# EAGLE board Speccy2007_128KY (EAGLE 6.4), part 1 of 2
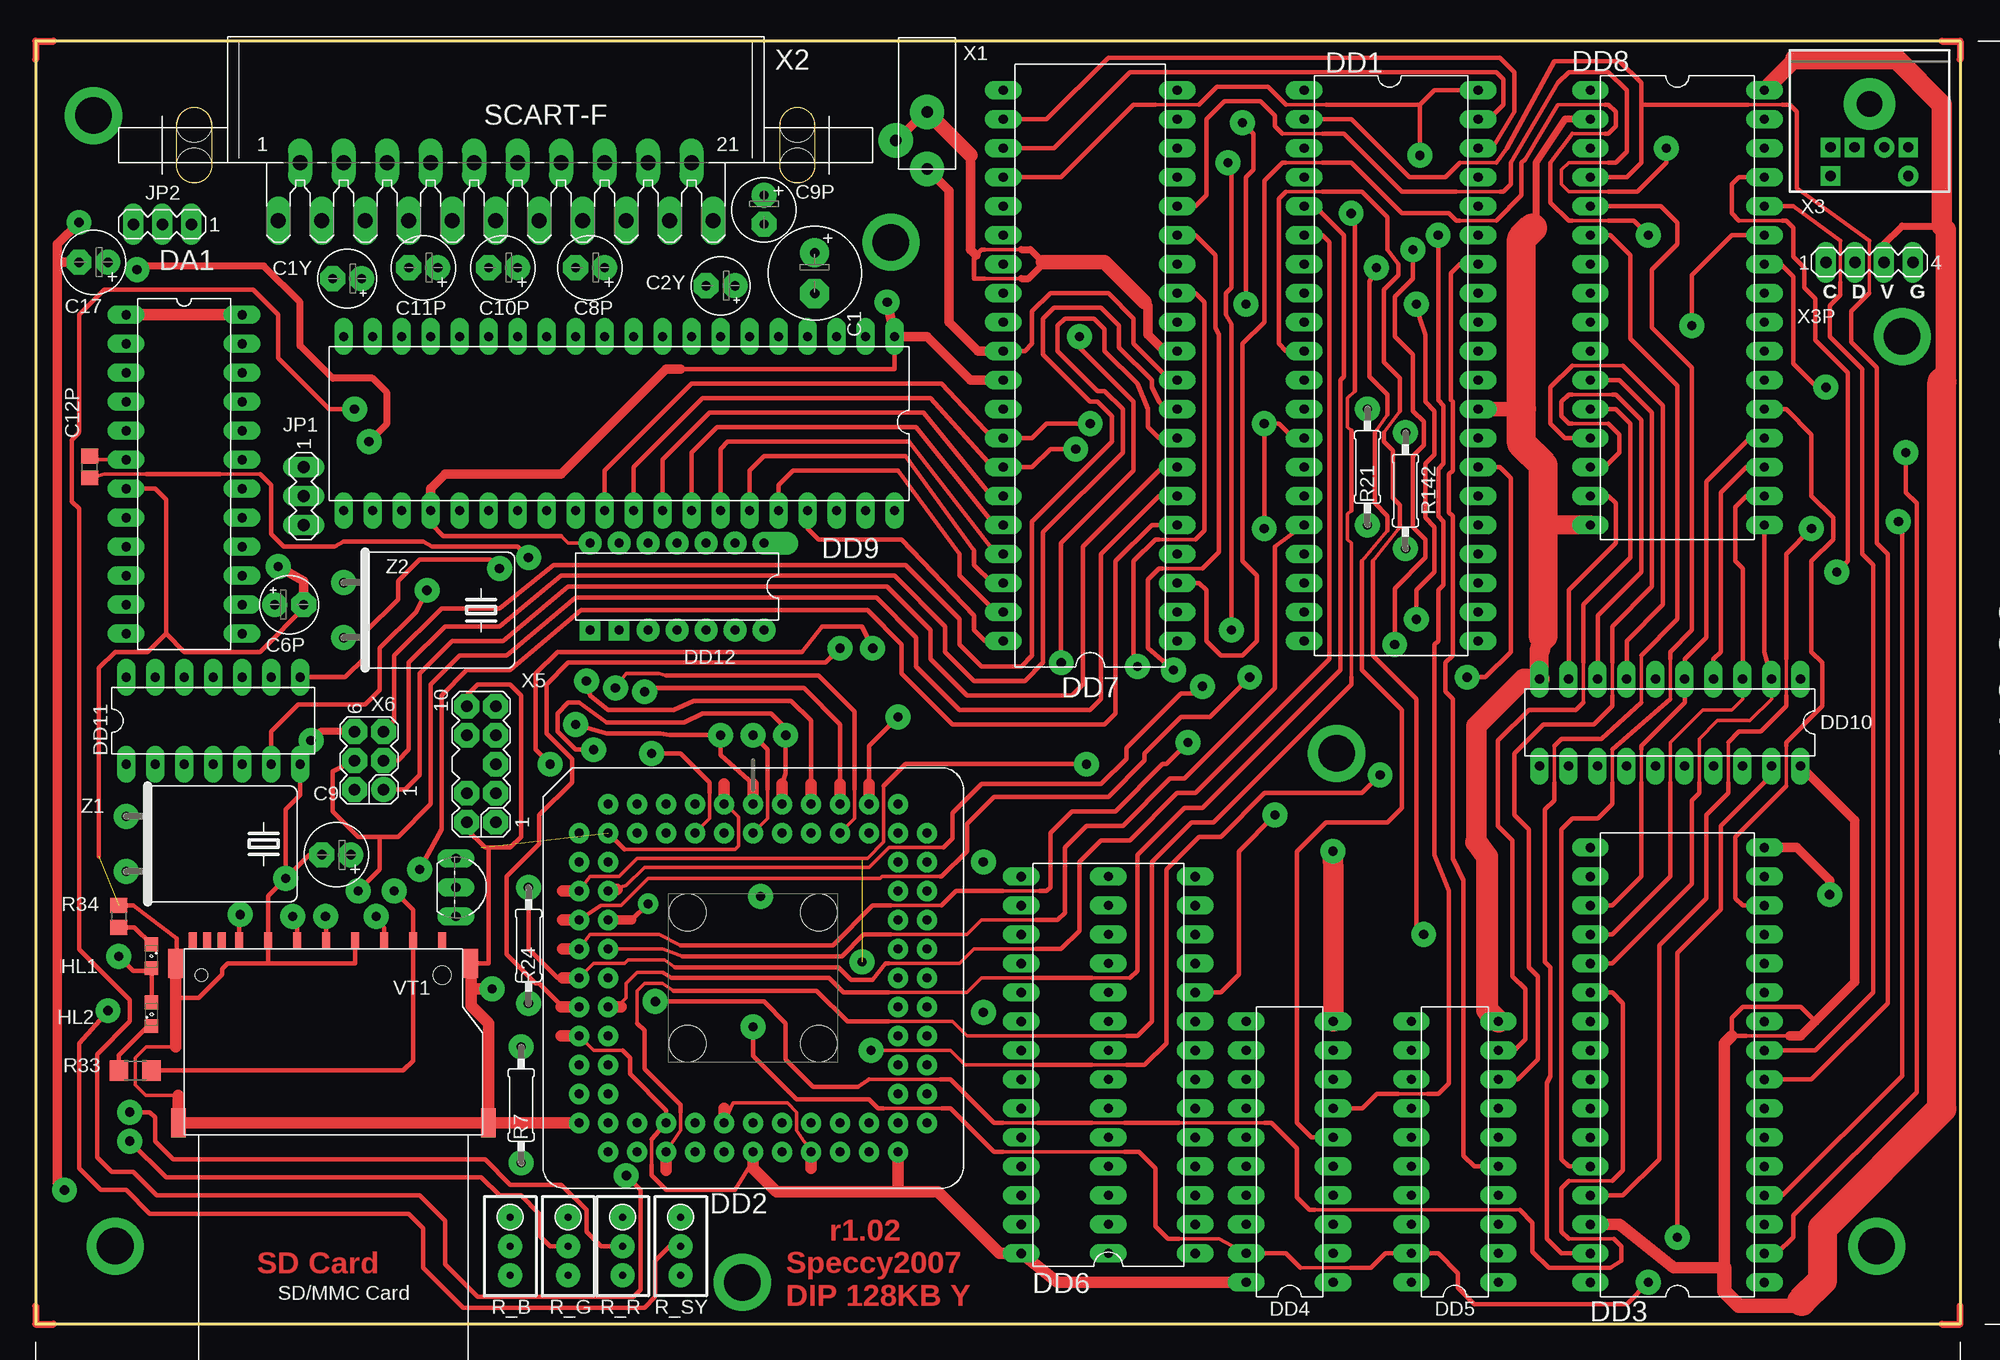
[diagram p1: board, top side]
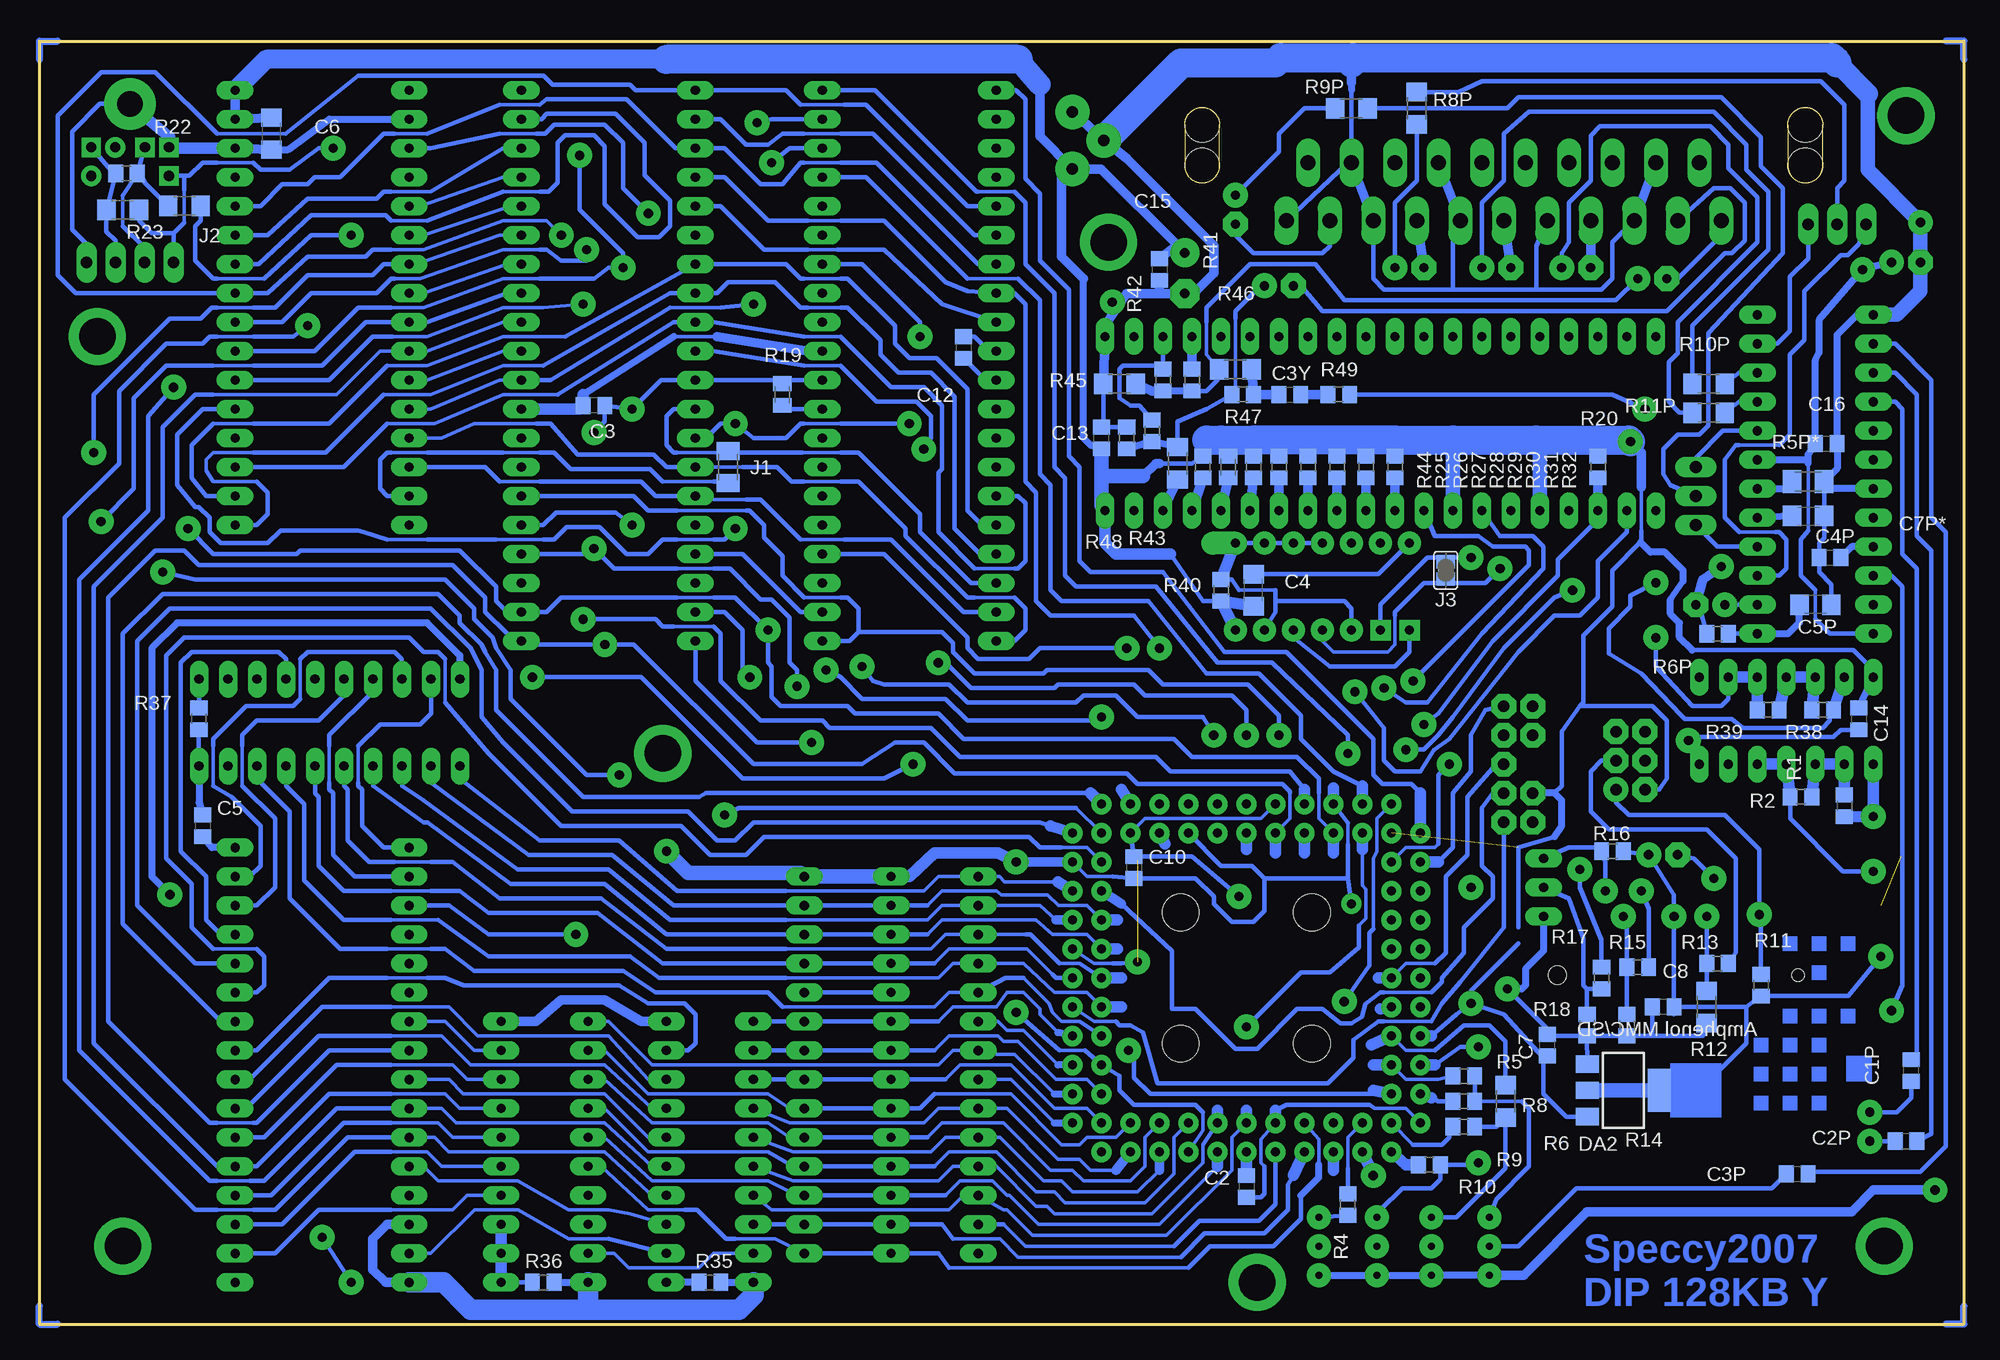
[diagram p2: board, bottom side, seen from below]

Size 168.59 x 112.39 mm. Coordinates in mm from the lower left corner, seen from the top.
Outline: 168.59,112.4 0,112.4 0,0 168.59,0 168.59,112.4
Copper layers (1*16): Top 0.035mm / dielectric 1.5mm / Bottom 0.035mm
Design rules "default": minimum track width 10mil, minimum drill 24mil, track to track 8mil, track to pad 8mil, pad to pad 8mil, via to via 8mil, smd to smd 8mil, copper to edge 40mil, drill to drill 7mil, minimum pad ring 0.4mm, minimum via ring 8mil, stop-mask expansion 4mil, vias tented up to drill 0mil, thermal gap 10mil

## Footprints (pad centres in the part's own frame; a part is rotated, then mirrored left to right if it is on the bottom)
E3,5-8 = drill 0.813 pad 2.54: + -1.778,0 | drill 0.813 pad 2.54 octagon: - 1.778,0
C0805 = smd 1.3 x 1.5: 1 -0.95,0; 2 0.95,0
E2,5-5 = drill 0.813 pad 2.184: + -1.27,0 | drill 0.813 pad 2.184 octagon: - 1.27,0
C1206 = smd 1.6 x 1.8: 1 -1.4,0; 2 1.4,0
E2,5-6 = drill 0.813 pad 2.184: + -1.27,0 | drill 0.813 pad 2.184 octagon: - 1.27,0
DIL24-4 = drill 0.813 long: 1 -13.97,-5.08; 2 -11.43,-5.08; 3 -8.89,-5.08; 4 -6.35,-5.08; 5 -3.81,-5.08; 6 -1.27,-5.08; 7 1.27,-5.08; 8 3.81,-5.08; 9 6.35,-5.08; 10 8.89,-5.08; 11 11.43,-5.08; 12 13.97,-5.08; 13 13.97,5.08; 14 11.43,5.08; 15 8.89,5.08; 16 6.35,5.08; 17 3.81,5.08; 18 1.27,5.08; 19 -1.27,5.08; 20 -3.81,5.08; 21 -6.35,5.08; 22 -8.89,5.08; 23 -11.43,5.08; 24 -13.97,5.08
SOT-223 = smd 1.5 x 2: 1 -2.3,-3.15; 2 0,-3.15; 3 2.3,-3.15 | smd 3.8 x 2: 4 0,3.15
DIL40 = drill 0.813 long: 1 -24.13,-7.62; 2 -21.59,-7.62; 3 -19.05,-7.62; 4 -16.51,-7.62; 5 -13.97,-7.62; 6 -11.43,-7.62; 7 -8.89,-7.62; 8 -6.35,-7.62; 9 -3.81,-7.62; 10 -1.27,-7.62; 11 1.27,-7.62; 12 3.81,-7.62; 13 6.35,-7.62; 14 8.89,-7.62; 15 11.43,-7.62; 16 13.97,-7.62; 17 16.51,-7.62; 18 19.05,-7.62; 19 21.59,-7.62; 20 24.13,-7.62; 21 24.13,7.62; 22 21.59,7.62; 23 19.05,7.62; 24 16.51,7.62; 25 13.97,7.62; 26 11.43,7.62; 27 8.89,7.62; 28 6.35,7.62; 29 3.81,7.62; 30 1.27,7.62; 31 -1.27,7.62; 32 -3.81,7.62; 33 -6.35,7.62; 34 -8.89,7.62; 35 -11.43,7.62; 36 -13.97,7.62; 37 -16.51,7.62; 38 -19.05,7.62; 39 -21.59,7.62; 40 -24.13,7.62
PGA-84-B = drill 0.8 pad 1.778: 1 0,15.24; 2 0,12.7; 3 -2.54,15.24; 4 -2.54,12.7; 5 -5.08,15.24; 6 -5.08,12.7; 7 -7.62,15.24; 8 -7.62,12.7; 9 -10.16,15.24; 10 -10.16,12.7; 11 -12.7,15.24; 12 -15.24,12.7; 13 -12.7,12.7; 14 -15.24,10.16; 15 -12.7,10.16; 16 -15.24,7.62; 17 -12.7,7.62; 18 -15.24,5.08; 19 -12.7,5.08; 20 -15.24,2.54; 21 -12.7,2.54; 22 -15.24,0; 23 -12.7,0; 24 -15.24,-2.54; 25 -12.7,-2.54; 26 -15.24,-5.08; 27 -12.7,-5.08; 28 -15.24,-7.62; 29 -12.7,-7.62; 30 -15.24,-10.16; 31 -12.7,-10.16; 32 -15.24,-12.7; 33 -12.7,-15.24; 34 -12.7,-12.7; 35 -10.16,-15.24; 36 -10.16,-12.7; 37 -7.62,-15.24; 38 -7.62,-12.7; 39 -5.08,-15.24; 40 -5.08,-12.7; 41 -2.54,-15.24; 42 -2.54,-12.7; 43 0,-15.24; 44 0,-12.7; 45 2.54,-15.24; 46 2.54,-12.7; 47 5.08,-15.24; 48 5.08,-12.7; 49 7.62,-15.24; 50 7.62,-12.7; 51 10.16,-15.24; 52 10.16,-12.7; 53 12.7,-15.24; 54 15.24,-12.7; 55 12.7,-12.7; 56 15.24,-10.16; 57 12.7,-10.16; 58 15.24,-7.62; 59 12.7,-7.62; 60 15.24,-5.08; 61 12.7,-5.08; 62 15.24,-2.54; 63 12.7,-2.54; 64 15.24,0; 65 12.7,0; 66 15.24,2.54; 67 12.7,2.54; 68 15.24,5.08; 69 12.7,5.08; 70 15.24,7.62; 71 12.7,7.62; 72 15.24,10.16; 73 12.7,10.16; 74 15.24,12.7; 75 12.7,15.24; 76 12.7,12.7; 77 10.16,15.24; 78 10.16,12.7; 79 7.62,15.24; 80 7.62,12.7; 81 5.08,15.24; 82 5.08,12.7; 83 2.54,15.24; 84 2.54,12.7 | hole 3.2: -5.745,5.745; 5.745,5.745; -5.745,-5.745; 5.745,-5.745
DIL32 = drill 0.813 long: 1 -19.05,-7.62; 2 -16.51,-7.62; 3 -13.97,-7.62; 4 -11.43,-7.62; 5 -8.89,-7.62; 6 -6.35,-7.62; 7 -3.81,-7.62; 8 -1.27,-7.62; 9 1.27,-7.62; 10 3.81,-7.62; 11 6.35,-7.62; 12 8.89,-7.62; 13 11.43,-7.62; 14 13.97,-7.62; 15 16.51,-7.62; 16 19.05,-7.62; 17 19.05,7.62; 18 16.51,7.62; 19 13.97,7.62; 20 11.43,7.62; 21 8.89,7.62; 22 6.35,7.62; 23 3.81,7.62; 24 1.27,7.62; 25 -1.27,7.62; 26 -3.81,7.62; 27 -6.35,7.62; 28 -8.89,7.62; 29 -11.43,7.62; 30 -13.97,7.62; 31 -16.51,7.62; 32 -19.05,7.62
DIL20 = drill 0.813 long: 1 -11.43,-3.81; 2 -8.89,-3.81; 3 -6.35,-3.81; 4 -3.81,-3.81; 5 -1.27,-3.81; 6 1.27,-3.81; 7 3.81,-3.81; 8 6.35,-3.81; 9 8.89,-3.81; 10 11.43,-3.81; 11 11.43,3.81; 12 8.89,3.81; 13 6.35,3.81; 14 3.81,3.81; 15 1.27,3.81; 16 -1.27,3.81; 17 -3.81,3.81; 18 -6.35,3.81; 19 -8.89,3.81; 20 -11.43,3.81
DIL28+6 = drill 0.813 long: 1 -16.51,-7.62; 2 -13.97,-7.62; 3 -11.43,-7.62; 4 -8.89,-7.62; 5 -6.35,-7.62; 6 -3.81,-7.62; 7 -1.27,-7.62; 8 1.27,-7.62; 9 3.81,-7.62; 10 6.35,-7.62; 11 8.89,-7.62; 12 11.43,-7.62; 13 13.97,-7.62; 14 16.51,-7.62; 15 16.51,7.62; 16 13.97,7.62; 17 11.43,7.62; 18 8.89,7.62; 19 6.35,7.62; 20 3.81,7.62; 21 1.27,7.62; 22 -1.27,7.62; 23 -3.81,7.62; 24 -6.35,7.62; 25 -8.89,7.62; 26 -11.43,7.62; 27 -13.97,7.62; 28 -16.51,7.62 | drill 0.8 long: P$1 -16.51,0; P$2 -13.97,0; P$3 -11.43,0; P$4 -8.89,0; P$5 -6.35,0; P$6 -3.81,0; P$7 -1.27,0; P$8 1.27,0; P$9 3.81,0; P$10 6.35,0; P$11 8.89,0; P$12 11.43,0; P$13 13.97,0; P$14 16.51,0
DIL14 = drill 0.813 long: 1 -7.62,-3.81; 2 -5.08,-3.81; 3 -2.54,-3.81; 4 0,-3.81; 5 2.54,-3.81; 6 5.08,-3.81; 7 7.62,-3.81; 8 7.62,3.81; 9 5.08,3.81; 10 2.54,3.81; 11 0,3.81; 12 -2.54,3.81; 13 -5.08,3.81; 14 -7.62,3.81
DIL14O = drill 0.813 pad 2 offset: 1 -7.62,-3.81 | drill 0.813 pad 2: 2 -5.08,-3.81; 3 -2.54,-3.81; 4 0,-3.81; 5 2.54,-3.81; 6 5.08,-3.81; 7 7.62,-3.81; 10 2.54,3.81; 11 0,3.81; 12 -2.54,3.81; 13 -5.08,3.81; 14 -7.62,3.81 | drill 0.813 pad 1.8 square: 8 7.62,3.81; 9 5.08,3.81
SML0805 = smd 1.2 x 1.2: A 1.05,0; C -1.05,0
M1206 = smd 1.6 x 2: 1 -1.4,0; 2 1.4,0
R1206 = smd 1.6 x 1.803: 1 -1.422,0; 2 1.422,0
SJ = smd 1.168 x 1.6: 1 -0.762,0; 2 0.762,0
MA03-1 = drill 1.016 long: 1 -2.54,0; 2 0,0; 3 2.54,0
R0805 = smd 1.3 x 1.5: 1 -0.95,0; 2 0.95,0
0207/10 = drill 0.813 pad 2.184: 1 -5.08,0; 2 5.08,0
M0805 = smd 1.3 x 1.6: 1 -0.95,0; 2 0.95,0
RTRIM3296W = drill 0.61 pad 2.1: 1 0,-2.54; 2 0,0; 3 0,2.54
TO92-CBE = drill 0.813 long: B 0,0; C -2.54,0; E 2.54,0
POWER3.5 = drill 1 pad 3: P$1 0,5; P$2 0,0; P$3 2.75,2.5
SCART-F = drill 1.321 long: 1 19.05,5.08; 2 17.145,0; 3 15.24,5.08; 4 13.335,0; 5 11.43,5.08; 6 9.525,0; 7 7.62,5.08; 8 5.715,0; 9 3.81,5.08; 10 1.905,0; 11 0,5.08; 12 -1.905,0; 13 -3.81,5.08; 14 -5.715,0; 15 -7.62,5.08; 16 -9.525,0; 17 -11.43,5.08; 18 -13.335,0; 19 -15.24,5.08; 20 -17.145,0; 21 -19.05,5.08 | hole 3.023: 26.416,0.254; 26.416,-3.302; -26.416,0.254; -26.416,-3.302
MINI-DIN6 = drill 0.9 pad 1.676 square: 1 -1.3,-8.5; 3 -3.4,-8.5; 4 3.4,-8.5; 5 -3.4,-11 | drill 0.9 pad 1.778: 2 1.3,-8.5; 6 3.4,-11 | drill 2.2 pad 4.5: GND 0,-4.7
MA04-1 = drill 1.016 long: 1 -3.81,0; 2 -1.27,0; 3 1.27,0; 4 3.81,0
SDCMF-10915W010 = smd 0.711 x 1.422: 1 7.366,13.462; 2 4.826,13.462; 3 2.286,13.462; 4 -0.254,13.462; 5 -2.794,13.462; 6 -5.334,13.462; 7 -7.874,13.462; 8 -9.398,13.462; 9 9.906,13.462; 10 -11.938,13.462; 11 -10.668,13.462 | smd 1.27 x 2.54: M1 12.43,11.43; M2 13.97,-2.54; M3 -13.208,-2.54; M4 -13.446,11.43 | hole 1.6: 9.906,10.414 | hole 1.1: -11.176,10.414
MA05-2 = drill 1.016 pad 2.184 octagon: 1 -5.08,-1.27; 2 -5.08,1.27; 3 -2.54,-1.27; 4 -2.54,1.27; 5 0,-1.27; 7 2.54,-1.27; 8 2.54,1.27; 9 5.08,-1.27; 10 5.08,1.27
MA03-2 = drill 1.016 pad 2.184: 1 -2.54,-1.27 | drill 1.016 pad 2.184 octagon: 2 -2.54,1.27; 3 0,-1.27; 4 0,1.27; 5 2.54,-1.27; 6 2.54,1.27
HC49U-H = drill 0.813 pad 2.184: 1 -2.413,-5.08; 2 2.413,-5.08

## Placement (x,y rotation side)
C1  1000mfx6.3v  [E3,5-8]  68.26,92.07 270 top
C1P  100n  [C0805]  4.6,22.23 90 bottom
C1Y  1m  [E2,5-5]  27.3,91.6 180 top
C2  100n  [C0805]  62.86,12.06 270 bottom
C2P  100n  [C0805]  5.08,16.03 0 bottom
C2Y  1m  [E2,5-5]  60.01,90.96 180 top
C3  100n  [C0805]  120.02,80.49 180 bottom
C3P  100n  [C0805]  14.61,13.18 0 bottom
C3Y  100n  [C0805]  59.05,81.44 0 bottom
C4  100n  [C1206]  62.23,64.29 90 bottom
C4P  100n  [C0805]  11.75,67.15 0 bottom
C5  100n  [C0805]  154.31,43.66 270 bottom
C5P  100n  [C1206]  13.02,63.02 180 bottom
C6  100n  [C1206]  148.27,104.3 270 bottom
C6P  10mf  [E2,5-5]  22.22,63.02 0 top
C7  100n  [C0805]  36.51,24.45 90 bottom
C7P*  33  [C1206]  13.65,70.8 0 bottom
C8  100n  [C0805]  26.35,27.78 180 bottom
C8P  220mf  [E2,5-6]  48.58,92.55 180 top
C9  220mf(47mf)  [E2,5-6]  26.35,41.12 180 top
C9P  220mf  [E2,5-6]  63.82,97.63 270 top
C10  100n  [C0805]  72.71,40.01 270 bottom
C10P  220mf  [E2,5-6]  40.96,92.55 180 top
C11P  220mf  [E2,5-6]  33.97,92.55 180 top
C12  100n  [C0805]  87.63,85.57 270 bottom
C12P  47  [C0805]  4.76,75.09 90 top
C13  100n  [C0805]  75.56,77.63 90 bottom
C14  100n  [C0805]  9.21,53.02 270 bottom
C15  100n  [C0805]  70.48,92.39 270 bottom
C16  100n  [C0805]  12.07,77.15 0 bottom
C17  220mf  [E2,5-6]  5.08,93.03 180 top
DA1  CXA1645P  [DIL24-4]  13.02,74.45 270 top
DA2  L1117-3.3  [SOT-223]  29.84,20.48 270 bottom
DD1  Z80  [DIL40]  118.75,83.98 270 top
DD2  EPM7128SLC84-15  [PGA-84-B]  62.86,30.32 0 top
DD3  621024  [DIL32]  143.83,22.7 90 top
DD4  74HCT245N  [DIL20]  109.86,15.09 90 top
DD5  74HCT245N  [DIL20]  124.34,15.09 90 top
DD6  62256  [DIL28+6]  93.98,22.7 90 top
DD7  ATMEGA32-P  [DIL40]  92.39,83.98 90 top
DD8  W29C020C  [DIL32]  143.83,89.06 270 top
DD9  YM2149F  [DIL40]  51.12,78.9 180 top
DD10  74HCT245N  [DIL20]  143.18,52.7 180 top
DD11  74LS04  [DIL14]  15.56,52.86 0 top
DD12  74LS74  [DIL14O]  56.2,64.61 180 top
HL1  power  [SML0805]  10.16,32.23 270 top
HL2  sdcard  [SML0805]  10.16,27.15 90 top
J1  0  [M1206]  108.27,75.09 270 bottom
J2  0  [R1206]  155.89,97.95 180 bottom
J3  [SJ]  45.4,66.04 90 bottom
JP1  [MA03-1]  23.49,72.55 270 top
JP2  [MA03-1]  11.11,96.36 180 top
R1  390  [R0805]  10.48,45.4 90 bottom
R2  390  [R0805]  14.29,46.2 180 bottom
R4  330  [R0805]  53.98,10.48 270 bottom
R5  470  [R0805]  43.81,21.75 0 bottom
R5P*  16k  [M1206]  13.65,73.82 180 bottom
R6  470  [R1206]  40.16,19.53 270 bottom
R6P  47k  [R0805]  21.59,60.48 0 bottom
R7  470  [0207/10]  42.55,19.21 270 top
R8  330  [R0805]  43.81,19.53 0 bottom
R8P  75  [R1206]  47.94,106.52 270 bottom
R9  330  [R0805]  43.81,17.3 0 bottom
R9P  75  [R1206]  53.66,106.52 180 bottom
R10  330  [R0805]  46.83,13.97 0 bottom
R10P  75  [R1206]  22.38,82.39 180 bottom
R11  10k  [R0805]  17.78,29.69 270 bottom
R11P  75  [R1206]  22.38,79.85 180 bottom
R12  2k2  [R1206]  22.54,27.78 90 bottom
R13  1k  [R0805]  21.59,31.59 0 bottom
R14  2k2  [R0805]  29.53,26.19 90 bottom
R15  1k  [R0805]  28.57,31.27 0 bottom
R16  10k  [R0805]  30.8,41.43 0 bottom
R17  2k2  [R0805]  31.75,30.32 90 bottom
R18  2k2  [R0805]  33.02,26.19 90 bottom
R19  10k  [M0805]  103.5,81.44 270 bottom
R20  10k  [R0805]  32.07,75.09 270 bottom
R21  10k  [0207/10]  116.68,75.09 270 top
R22  4k7  [R0805]  160.97,100.81 180 bottom
R23  4k7  [R1206]  161.29,97.63 0 bottom
R24  2k2  [0207/10]  43.18,33.18 90 top
R25  10k  [R0805]  66.67,75.09 90 bottom
R26  10k  [M0805]  64.45,75.09 90 bottom
R27  10k  [R0805]  62.23,75.09 90 bottom
R28  10k  [R0805]  60.01,75.09 90 bottom
R29  10k  [R0805]  57.47,75.09 90 bottom
R30  10k  [R0805]  54.93,75.09 90 bottom
R31  10k  [R0805]  52.39,75.09 90 bottom
R32  10k  [R0805]  49.85,75.09 90 bottom
R33  150  [R1206]  8.73,22.23 180 top
R34  150  [R0805]  7.3,35.72 270 top
R35  1k  [R0805]  109.86,3.65 0 bottom
R36  1k  [R0805]  124.46,3.65 0 bottom
R37  1k  [R0805]  154.62,53.02 270 bottom
R38  390  [R0805]  12.38,53.82 180 bottom
R39  390  [R0805]  17.14,53.82 180 bottom
R40  1k  [R0805]  65.09,64.29 270 bottom
R41  1k  [R0805]  67.63,82.71 270 bottom
R42  2k  [R0805]  70.17,82.71 270 bottom
R43  2k  [R0805]  71.12,78.26 270 bottom
R44  1k  [R1206]  68.9,75.41 90 bottom
R45  5k1  [R1206]  73.98,82.39 180 bottom
R46  4k7  [R1206]  63.82,83.66 0 bottom
R47  4k7  [R0805]  63.18,81.44 0 bottom
R48  5k1  [R0805]  73.34,77.63 90 bottom
R49  4k7  [R0805]  54.77,81.44 0 bottom
R142  10k  [0207/10]  120.02,73.02 270 top
R_B  1k  [RTRIM3296W]  41.59,6.83 180 top
R_G  1k  [RTRIM3296W]  46.67,6.83 180 top
R_R  1k  [RTRIM3296W]  51.44,6.83 180 top
R_SY  1k  [RTRIM3296W]  56.52,6.83 180 top
VT1  BC337  [TO92-CBE]  36.83,38.26 270 top
X1  5V  [POWER3.5]  78.11,106.2 180 top
X2  SCART-F  [SCART-F]  40.32,101.76 180 top
X3  PS/2 KB  [MINI-DIN6]  160.66,111.6 0 top
X3P  KB  [MA04-1]  160.66,93.03 0 top
X4  SD Card  [SDCMF-10915W010]  25.72,20.16 0 top
X5  ByteBlaster  [MA05-2]  39.05,49.05 90 top
X6  AVRISP  [MA03-2]  29.21,49.37 90 top
Z1  14Mhz  [HC49U-H]  13.02,42.07 270 top
Z2  8867.232KHz / 4..20pf  [HC49U-H]  32.07,62.55 270 top

## Tracks (layer width: path | path; a pad name or v marks a point on that pad's centre or on a via)
+3V3  (via drill 0.8 pad 2.18)
  Top 0.406: X4.4 25.46,35.02 v25.4,35.72 | HL2.A 10.16,30.96 | 10.16,30.96 HL1.A | 10.16,30.96 8.57,30.96 v7.3,32.23
  Bottom 0.406: 19.05,27.78 R11.2 10.16,28.74 v7.3,32.23 | 19.05,27.78 C8.1 | DA2.4 23.18,20.48 19.05,24.61 19.05,27.46 19.05,27.78 | C8.1 25.4,27.15 C8.1 | C8.1 v25.4,35.72 25.4,37.62 C9.+ R16.2
  Bottom 1.27: DA2.2 DA2.4
+5V  (via drill 0.8 pad 2.18)  (2 unrouted)
  Top 0.305: 153.67,25.24 149.86,25.24 | DD2.26 48.89,23.97 51.44,23.97 | DD2.3 60.48,45.56 61.59,44.45 61.59,41.91 61.28,41.59 51.59,41.59 | 53.98,16.19 53.98,13.97
  Top 0.406: 149.86,25.24 148.59,25.24 148.59,26.83 149.54,27.78 154.62,27.78 155.89,26.51 | 51.44,23.97 52.07,23.34 52.07,21.91 55.24,18.73 DD2.38 53.98,16.19 | DD7.10 99.38,82.71 96.2,85.88 96.2,88.11 93.98,90.33 88.9,90.33 87.31,88.74 87.31,85.88 86.68,85.25 DD7.30 | 51.59,41.59 DD2.13 | 62.86,14.29 61.28,11.75 55.24,11.75 53.98,13.02 53.98,13.97
  Top 0.61: v29.21,77.31 30.8,78.9 30.8,81.6 29.53,82.87 26.04,82.87 23.18,85.72 23.18,89.54 20,92.71 9.53,92.71 v8.89,92.39 | 167,96.2 163.51,96.2 161.93,94.62 X3P.3
  Top 0.813: DD10.20 159.38,44.12 159.38,30 155.89,26.51 154.62,25.24 153.67,25.24 | DD7.30 82.55,85.25 80.01,87.79 80.01,99.3 X1.P$1
  Top 1.016: 75.56,11.59 64.93,11.59 62.86,13.65 62.86,14.29 DD2.43 | 75.56,11.59 DD2.53 | 75.56,11.59 79.06,11.59 84.45,6.19 DD6.28 89.53,3.66 DD4.20 | 148.59,25.24 147.96,24.61 147.96,4.92 143.51,4.92 138.75,8.73 DD3.30 | DD2.3 60.32,47.31 | DD2.26 46.04,25.24
  Top 1.27: 147.96,4.92 147.96,2.86 149.22,1.59 154.62,1.59 154.7,1.98
  Top 1.422: 154.15,110.81 DD8.32
  Top 1.778: 167,82.55 167.32,82.87 167.32,95.88 167,96.2 167,106.84 163.04,110.81 154.15,110.81
  Top 2.54: 167,82.55 167,18.89 156.53,8.41 156.53,3.81 154.7,1.98
  Bottom 0.305: 13.02,64.29 13.02,61.75 | DD2.3 61.59,44.29 71.75,44.29 DD2.78 | 28.26,69.53 28.26,73.34 | DD2.66 76.2,31.59 74.61,31.59 | 13.65,75.41 13.65,69.53
  Bottom 0.406: 70.48,75.41 67.62,75.41 R25.2 | 161.93,100.49 R22.2 | C12.1 86.67,86.52 85.41,85.25 DD7.30 | 46.67,25.24 44.45,27.15 R24.1 | 35.88,42.7 39.05,41.75 39.05,34.77 | 36.83,23.34 40.32,27.15 R24.1 | 36.83,23.34 36.83,20.16 34.85,18.18 DA2.3 | 43.18,29.05 R24.1 | 69.53,67.47 66.67,63.34 R40.2 | X6.2 26.67,46.83 26.04,47.78 26.04,52.86 27.3,54.13 33.66,54.13 | 33.66,54.13 35.24,51.91 35.24,47.15 35.88,46.51 | 13.02,64.29 14.29,65.56 14.29,68.74 13.65,69.53 | 13.02,61.75 11.75,60.48 DA1.12 | R22.2 162.08,100.81 X3.4 | R22.2 R23.1 162.72,95.73 161.93,94.93 X3P.3 | DD7.10 103,82.71 | 103,82.71 104.01,82.71 | 104.01,82.71 R19.1 103,82.71 | 104.01,82.71 DD1.11 114.14,82.71 R21.1 C3.1 119.06,79.05 R142.1 | DD2.78 C10.1 67.62,40.95 v63.5,37.47 | 74.61,31.59 73.82,31.59 v72.39,31.75 | DD10.20 R37.2 | 123.36,3.66 R36.2 | 33.66,54.13 33.34,54.45 33.34,60.33 30.8,62.87 30.8,66.04 28.34,68.5 28.26,68.58 28.26,69.53 | 36.83,23.34 36.67,23.5 C7.1 | R32.2 49.85,77.47 | R31.2 52.7,77.47 | 54.61,77.47 R30.2 54.61,77.79 54.93,77.79 54.93,78.1 54.61,78.1 | R29.2 57.47,77.47 57.15,77.47 | R28.2 60.01,77.47 | R27.2 62.23,77.47 | 78.11,101.28 X1.P$1 | 39.05,33.34 43.18,29.21 R24.1 | DD11.14 7.94,57.31 9.68,59.05 23.81,59.05
  Bottom 0.508: 25.72,63.5 24.61,65.09
  Bottom 0.61: DD10.20 154.61,45.68 C5.1 | X5.4 35.88,46.51 35.24,45.88 35.24,43.66 35.88,42.7 | C13.1 76.52,77 77.15,77.63 77.15,91.6 | C17.+ v8.89,92.39 12.7,87.95 12.7,85.09 13.02,84.46 C16.1 13.65,76.2 13.65,75.88 | 13.65,75.41 13.65,75.88 | DA1.19 13.81,75.72 13.65,75.88 | 79.06,100.33 78.11,101.28 | R35.2 DD4.20 | 123.36,3.66 DD5.20 | C14.1 DD11.14 | R25.2 66.67,77.15 66.04,77.47 66.36,77.47 | 72.39,40.64 C10.1 | 23.81,59.05 24.92,60.17 24.92,61.44 25.72,62.23 25.72,63.5 | 24.61,65.09 24.61,66.04 26.19,67.63 27.46,67.63 28.34,68.5
  Bottom 0.813: DD8.32 DD8.31 C6.1 | DD3.30 138.11,8.73 139.38,7.46 139.38,4.76 138.27,3.65 DD3.32 | 77.15,91.6 79.06,93.5 79.06,100.33 | 28.26,73.34 28.26,76.36 v29.21,77.31 | 80.96,108.58 80.96,104.06 X1.P$1 75.61,101.2 68.96,94.55 | C1.+ 68.96,94.55 | C15.1 68.96,94.55 | 71.91,74.29 70.8,75.41 70.48,75.41
  Bottom 1.016: DD2.43 C2.1 | DD2.26 46.67,25.24 | DD9.40 75.25,68.42 74.3,67.47 69.53,67.47 | C4.1 R40.2 DD12.14 | R20.1 32.07,77.47
  Bottom 1.27: DD9.25 37.15,77.15 37.46,77.47 | DD9.28 44.77,77.47 | C13.1 75.56,74.29 | 75.56,74.29 75.56,71.76 DD9.40 | 71.91,74.29 75.56,74.29 | R26.2 64.45,77.15 65.09,77.47
  Bottom 1.676: 113.66,110.81 148.75,110.81 DD8.32
  Bottom 1.778: DD3.32 133.19,3.65 130.81,1.27 120.33,1.27 | 120.33,1.27 107.31,1.27 106.05,2.54 DD4.20 | DD5.20 120.53,1.47 120.33,1.27
  Bottom 1.93: 80.96,108.58 82.87,110.81
  Bottom 2.54: 82.87,110.81 113.66,110.81 | v29.21,77.31 29.37,77.47 32.07,77.47 37.46,77.47 44.77,77.47 49.85,77.47 52.7,77.47 54.61,77.47 57.15,77.47 60.01,77.47 62.23,77.47 65.09,77.47 66.36,77.47
A0  (via drill 0.8 pad 2.18)
  Top 0.305: 135.57,57.94 135.57,54.45
  Top 0.406: DD5.9 129.54,23.98 130.49,24.94 130.49,29.37 129.38,30.48 129.38,42.39 128.11,43.66 128.11,51.12 130.81,53.82 134.94,53.82 135.57,54.45 | v106.05,89.38 106.05,100.49 106.68,101.12 106.68,104.3 v105.73,105.25 | DD8.12 138.43,80.17 139.7,78.9 139.7,67.15 135.57,63.02 135.57,57.94
  Bottom 0.305: DD5.9 130.5,23.98 133.03,26.51 DD3.23 | DD1.30 128.27,82.71 134.3,80.17 DD8.12 | 113.35,89.06 108.9,89.06
  Bottom 0.406: DD1.30 123.83,82.71 113.35,89.06 | 108.9,89.06 v106.05,89.38 | DD7.19 104.46,105.57 v105.73,105.25
A1
  Top 0.305: 138.11,57.94 138.11,55.09
  Top 0.406: DD5.8 129.86,21.44 131.6,23.19 131.6,30.48 130.81,31.27 130.81,43.34 129.54,44.61 129.54,50.01 132.08,52.55 136.53,52.55 138.11,54.13 138.11,55.09 | DD8.11 138.75,82.71 141.6,79.85 141.6,64.61 138.11,61.12 138.11,57.94
  Bottom 0.305: DD5.8 131.14,21.44 132.4,22.7 137.79,22.7 | DD1.31 127.95,85.25 134.62,82.71 DD8.11
  Bottom 0.406: 137.79,22.7 142.56,22.7 148.91,16.35 DD3.6
A2
  Bottom 0.305: DD5.7 131.78,18.9 133.03,20.16 137.79,20.16 | DD1.32 127.95,87.79 134.62,85.25 DD8.10 138.75,85.25 142.56,81.44 153.35,81.44
  Bottom 0.406: 153.35,81.44 154.94,81.44 157.8,78.58 157.8,70.64 163.83,64.61 163.83,24.61 153.03,13.81 DD3.5 149.54,13.81 143.19,20.16 137.79,20.16
A3  (via drill 0.8 pad 2.18)
  Top 0.406: DD3.4 153.03,11.27 163.51,21.75 163.51,70.01 v163.19,70.33
  Bottom 0.305: 149.86,83.98 153.35,83.98 | DD5.6 132.41,16.36 133.67,17.62 137.79,17.62
  Bottom 0.406: DD1.33 127.63,90.33 134.62,87.79 DD8.9 140.02,87.79 143.83,83.98 149.86,83.98 | 137.79,17.62 141.92,17.62 148.27,11.27 DD3.4 | v163.19,70.33 160.34,73.18 160.34,81.12 157.48,83.98 153.35,83.98
A4
  Top 0.305: 128.16,13.81 DD5.5
  Top 0.406: DD1.34 124.78,92.87 123.98,92.07 123.98,80.96 124.14,80.8 124.14,74.77 123.83,74.45 123.83,71.12 124.14,70.8 124.14,58.58 123.51,57.94 123.51,55.4 124.14,54.77 124.14,40.8 125.09,38.89 125.09,14.76 126.05,13.81 128.14,13.81 DD5.5
  Bottom 0.305: 127.63,92.87 134.94,90.33 DD8.8 | 137.79,15.08 134.62,15.08 133.35,13.81 128.16,13.81 DD5.5
  Bottom 0.406: 127.63,92.87 DD1.34 | 137.79,15.08 140.97,15.08 147.32,8.73 DD3.3
A5  (via drill 0.8 pad 2.18)
  Top 0.406: v163.83,76.36 163.83,72.87 164.78,71.91 164.78,20.32 153.99,9.53 153.99,7.62 152.56,6.19 DD3.2
  Bottom 0.305: DD5.4 131.12,11.28 132.4,10 137.79,10 | 149.86,89.06 153.03,89.06 | DD1.35 128.27,95.41 135.57,92.87 DD8.7
  Bottom 0.406: DD8.7 138.43,92.87 139.38,91.92 145.1,91.92 147.96,89.06 149.86,89.06 | 137.79,10 144.15,10 147.96,6.19 DD3.2 | v163.83,76.36 163.83,81.44 157.16,88.11 154.46,88.11 153.51,89.06 153.03,89.06
A6
  Top 0.305: 140.65,58.58 140.65,54.45 | 133.03,50.64 133.03,47.47
  Top 0.406: DD3.31 133.67,6.19 132.4,7.46 132.4,21.11 132.72,21.75 132.72,31.27 132.24,31.75 132.24,45.08 133.03,45.88 133.03,47.47 | 133.03,50.64 133.67,51.28 137.16,51.28 140.65,54.45 | 140.65,58.58 143.83,61.75 143.83,82.23 139.7,86.36 139.7,93.66 137.95,95.41 DD8.6
  Bottom 0.305: DD3.31 134.3,6.19 130.48,10.01 126.67,10.01 122.24,7.46 118.75,7.46 | DD1.36 127.32,97.95 134.94,95.41 DD8.6
  Bottom 0.406: DD4.2 118.75,7.46
A7
  Top 0.305: 138.11,47.47 138.11,50.32 | 143.19,58.26 143.19,54.77
  Top 0.406: DD3.28 134.3,13.81 133.67,14.45 133.67,43.34 134.62,44.29 136.84,44.29 138.11,45.56 138.11,47.47 | 138.11,50.32 143.19,54.77 | DD8.5 142.4,97.95 143.83,96.52 143.83,94.62 141.6,92.39 141.6,87.31 145.1,83.82 145.1,60.8 143.19,58.9 143.19,58.26
  Bottom 0.305: DD3.28 134.94,13.81 133.67,12.54 126.68,12.54 122.24,10 118.75,10 116.84,9.68 DD4.3 | DD1.37 127.95,100.49 135.25,97.95 DD8.5
A8  (via drill 0.8 pad 2.18)
  Top 0.406: DD1.38 127.63,103.03 129.54,106.2 129.54,109.7 128.27,110.97 93.98,110.97 88.58,105.57 DD7.22 | v145.1,87.47 145.1,91.92 148.59,95.41 DD8.27
  Bottom 0.305: 137.79,99.22 134.3,99.22 127.95,103.03 DD1.38 | DD4.4 114.62,11.27 115.25,11.59 119.06,15.08 126.68,15.08 132.72,15.09 133.98,16.35 DD3.27 | 149.86,10 153.03,10 | 153.03,86.52 149.86,86.52
  Bottom 0.406: DD8.27 148.59,95.41 145.1,98.58 139.06,98.58 138.43,99.22 137.79,99.22 | 153.03,10 154.94,10 166.37,21.43 166.37,70.64 161.61,75.41 161.61,81.76 157.48,85.88 154.31,85.88 153.67,86.52 153.03,86.52 | DD3.27 141.6,16.35 147.96,10 149.86,10 | 149.86,86.52 146.37,86.52 v145.1,87.47
A9  (via drill 0.8 pad 2.18)
  Top 0.406: DD1.39 127.32,105.57 128.59,106.84 128.59,109.06 127.95,109.7 95.89,109.7 89.22,103.03 DD7.23 | v156.84,82.07 156.05,82.07 153.99,84.14 153.99,91.76 152.88,92.87 DD8.26
  Bottom 0.305: DD4.5 114.94,13.81 119.06,17.62 126.68,17.62 132.09,17.63 133.35,18.89 DD3.26 | 150.18,12.54 153.03,12.54 | 124.78,99.22 127.95,99.22 | 134.62,96.68 137.79,96.68
  Bottom 0.406: v156.84,82.07 159.07,79.53 159.07,71.28 165.1,65.25 165.1,23.97 153.67,12.54 153.03,12.54 | DD3.26 142.56,18.89 148.91,12.54 150.18,12.54 | DD8.26 149.38,92.87 144.78,97.16 138.27,97.16 137.79,96.68 | 127.95,99.22 134.62,96.68 | 124.78,99.22 123.98,99.22 123.19,100.01 123.19,103.51 122.55,104.14 120.02,104.14 119.06,103.19 119.06,98.11 116.2,95.25 114.3,95.25 113.35,96.2 113.35,98.43 115.57,100.65 115.57,103.51 118.11,106.04 124.14,106.04 124.62,105.57 DD1.39
A10  (via drill 0.8 pad 2.18)
  Top 0.305: 113.03,106.84 109.54,106.84 | 101.92,106.84 98.11,106.84 | 118.43,69.53 116.2,66.83 | 118.43,79.69 117.32,78.1
  Top 0.406: v117.47,92.55 116.84,91.28 116.84,83.03 118.43,81.44 118.43,79.69 | 98.11,106.84 96.2,106.84 89.85,100.49 DD7.24 | DD4.6 111.75,16.36 110.49,17.62 110.49,41.43 113.03,43.97 118.43,43.97 119.7,45.24 119.7,53.82 116.2,57.31 116.2,66.83 | 101.92,106.84 103.5,108.43 107.95,108.43 109.54,106.84 | 113.03,106.84 121.28,106.84 | 121.28,106.84 v121.28,102.39 | DD1.40 122.55,108.11 121.28,106.84 | 117.32,78.1 117.32,71.91 118.43,70.8 118.43,69.53
  Bottom 0.305: DD3.25 132.72,21.43 131.46,20.17 126.68,20.16 119.06,20.16 115.25,16.35 DD4.6 | 137.79,89.06 134.94,89.06 127.95,91.6 124.78,91.6
  Bottom 0.406: 124.78,91.6 120.02,91.6 118.75,92.55 v117.47,92.55 117.47,93.82 121.28,97.63 v121.28,102.39 | 137.79,89.06 140.65,89.06 144.46,85.25 DD8.23
A11  (via drill 0.8 pad 2.18)
  Top 0.305: 121.92,20.16 119.4,20.16
  Top 0.406: DD4.7 116.23,18.9 117.49,20.16 119.4,20.16 | 121.92,20.16 122.87,20.16 123.83,21.11 123.83,37.94 122.55,41.12 122.55,59.53 122.87,59.85 122.87,64.29 123.35,64.77 123.35,70.33 122.87,70.8 122.87,74.93 123.35,75.41 123.35,80.49 122.87,80.96 v122.87,95.41
  Bottom 0.305: 137.79,25.24 133.35,25.24 130.82,22.71 119.06,22.7 114.94,18.9 DD4.7 | 147,104.3 153.03,104.3 | 101.92,106.84 98.11,106.84 | v122.87,95.41 124.14,96.68 127.95,96.68 134.94,94.14 137.79,94.14
  Bottom 0.406: 147,104.3 140.65,109.38 124.43,109.38 123.64,108.58 116.84,108.58 116.36,108.11 DD1.1 103.19,108.11 101.92,106.84 | 137.79,94.14 139.38,94.14 140.02,93.5 145.1,93.5 148.59,90.33 DD8.25 165.42,90.33 167,91.92 167,105.89 163.19,109.7 158.43,109.7 153.03,104.3 | 137.79,25.24 144.15,25.24 150.5,18.89 DD3.7 | 98.11,106.84 96.2,106.84 87.31,97.95 DD7.25
A12
  Top 0.305: 127.95,101.76 124.78,101.76 | 153.03,106.84 150.04,106.84 | 160.66,90.33 160.66,94.93
  Top 0.406: DD8.4 139.38,100.49 140.65,101.76 140.65,106.84 | DD1.2 115.25,105.57 120.33,100.49 123.51,100.49 124.78,101.76 | DD3.8 155.57,21.43 162.24,28.1 162.24,67.47 161.29,68.42 161.29,83.82 159.07,86.04 159.07,88.74 160.66,90.33 | 127.95,101.76 128.91,103.03 133.03,110.65 138.75,110.65 140.65,108.74 140.65,106.84 | 150.04,106.84 140.65,106.84 | 153.03,106.84 153.67,106.84 154.31,106.2 154.31,99.54 160.66,94.93
  Bottom 0.305: 137.79,27.78 132.72,27.78 130.19,25.25 126.68,25.24 118.75,25.24 115.25,21.43 DD4.8 | 101.6,104.3 98.42,104.3
  Bottom 0.406: DD1.2 108.9,105.57 106.68,103.35 104.78,103.35 103.5,104.3 101.6,104.3 | 137.79,27.78 143.83,27.78 150.18,21.43 DD3.8 | 98.42,104.3 95.57,104.3 86.68,95.41 DD7.26
A13
  Top 0.305: 158.12,91.28 158.12,94.93
  Top 0.406: DD3.9 155.89,23.97 160.97,29.05 160.97,66.52 160.02,67.47 160.02,83.66 157.16,86.52 157.16,89.22 158.12,90.17 158.12,91.28 | DD8.28 153.99,97.95 158.12,94.93
  Bottom 0.305: 124.78,106.84 128.27,106.84 | 134.62,104.3 137.48,104.3 | 134.62,30.32 138.11,30.32 | 101.6,101.76 98.42,101.76
  Bottom 0.406: DD4.9 111.75,23.98 111.12,24.61 111.12,27.15 112.08,28.1 115.25,28.1 117.79,29.69 131.44,29.69 133.03,30.32 134.62,30.32 | DD8.28 149.22,97.95 147.32,99.85 145.1,99.85 144.46,100.49 142.24,100.49 138.43,104.3 137.48,104.3 | 101.6,101.76 101.92,101.76 103.5,99.85 105.41,99.85 108.58,103.03 DD1.3 112.87,103.03 117.16,107.32 124.14,107.32 124.78,106.84 | 138.11,30.32 143.19,30.32 149.54,23.97 DD3.9 | 98.42,101.76 95.25,101.76 86.36,92.87 DD7.27 | 134.62,104.3 128.27,106.84
A14  (via drill 0.8 pad 2.18)
  Top 0.406: DD1.4 111.76,100.49 | v70.48,59.21 69.22,57.94 46.67,57.94 44.77,56.04 44.77,51.75 46.99,49.53 46.99,47.47 44.13,44.61 44.13,42.07 41.27,39.21 41.27,32.38 43.81,29.85 44.13,29.85 46.04,27.94 46.04,27.78 | 47.31,27.78 DD2.24
  Top 1.016: DD2.24 46.04,27.78
  Bottom 0.305: 101.28,96.68 98.42,96.68
  Bottom 0.406: 101.28,96.68 104.78,96.68 108.58,100.49 DD1.4 | v70.48,59.21 72.71,62.07 80.01,62.07 81.28,63.34 81.28,72.87 82.23,73.82 82.23,89.38 83.19,90.33 DD7.28 87.31,90.49 89.22,91.28 94.61,96.68 98.42,96.68
A15
  Top 0.305: 74.77,29.05 81.6,29.05 82.87,30.32 87.31,30.32 | 55.72,30.32 54.93,30.8 52.7,30.8 51.75,29.85 51.75,28.58 50.96,27.78 DD2.25 | 95.89,30.32 92.55,30.32
  Top 0.406: 55.72,30.32 69.53,30.32 70.8,29.05 74.77,29.05 | DD1.5 112.39,97.63 114.62,95.41 114.62,83.03 114.3,82.71 114.3,57.31 102.23,45.24 100.65,45.24 96.52,41.12 96.52,30.96 95.89,30.32 | 92.55,30.32 87.31,30.32
  Top 1.016: DD2.25 51.28,27.78
  Bottom 0.305: 101.28,94.14 98.74,94.14
  Bottom 0.406: 101.28,94.14 105.09,94.14 108.9,97.95 DD1.5 | DD7.29 89.53,89.38 94.61,94.14 98.74,94.14
  Bottom 1.016: DD2.25 51.12,27.62
AVR_INT
  Bottom 0.305: 87.31,91.6 82.87,91.6
  Bottom 0.406: 52.7,47.15 55.24,48.42 58.1,51.28 58.1,53.34 61.75,56.99 66.36,56.99 71.44,63.34 79.06,63.34 80.01,64.29 80.01,73.5 80.96,74.45 80.96,89.69 82.87,91.6 | 87.31,91.6 96.2,100.49 DD7.17
  Bottom 1.016: DD2.9 52.7,47.15
AVR_NOINT  (via drill 0.8 pad 2.18)
  Top 0.305: DD2.6 59.05,44.29 59.05,46.51
  Top 0.406: 59.05,46.51 59.05,47.47 56.52,50.01 v53.98,50.01
  Bottom 0.305: 86.36,99.22 83.19,99.22 | 57.78,42.86 DD2.6
  Bottom 0.406: v53.98,50.01 53.98,51.59 60.64,57.94 65.41,57.94 70.8,64.61 77.79,64.61 78.74,65.56 78.74,74.14 79.69,75.09 79.69,90.33 82.23,92.87 82.23,98.27 83.19,99.22 | 86.36,99.22 86.52,99.22 95.41,108.11 DD7.20
  Bottom 1.016: 57.78,42.86 57.78,41.27
AVR_PROM  (via drill 0.8 pad 2.18)
  Top 0.305: DD2.2 64.14,44.29 64.14,46.83
  Top 0.406: 64.14,46.83 64.14,50.32 v62.86,51.59 | v89.85,57.94 89.85,68.42 96.2,74.77 96.2,80.8 91.44,85.57 v91.44,86.52
  Bottom 0.305: 62.86,42.86 DD2.2
  Bottom 0.406: v89.85,57.94 89.22,57.94 87,55.72 79.69,55.72 79.38,56.04 72.71,56.04 71.75,55.09 64.14,55.09 62.86,53.82 v62.86,51.59 | DD7.14 96.52,92.87 91.44,87.79 v91.44,86.52
  Bottom 1.016: 62.86,42.86 62.86,41.59
AVR_RST
  Top 0.406: DD7.9 99.06,80.17 98.42,80.8 97.79,82.07 97.79,82.71 94.93,85.57 94.93,87.47 93.34,89.06 89.22,89.06 88.27,88.11 88.27,84.93 92.39,80.8 93.03,80.8 94.3,79.53 94.3,77.31 87.31,70.33 87.31,58.58 86.36,57.63 82.87,57.63 80.96,59.53 80.96,61.75 76.2,66.52 45.4,66.52 40.64,62.71 35.56,62.71 31.43,58.58 31.43,52.86 X6.5
  Bottom 0.406: DD7.9 103.19,80.17 R19.2
AVR_TRDOS  (via drill 0.8 pad 2.18)
  Top 0.305: 102.23,66.2 98.74,66.2
  Top 0.406: 102.23,66.2 103.66,67.63 103.66,86.68 103.35,87.31 103.35,93.66 101.6,95.41 DD7.15 | 98.74,66.2 98.42,66.2 97.47,65.25 97.47,59.21 v99.69,57.31 | 73.03,47.31 73.03,50.64 v75.56,53.18
  Top 1.016: DD2.77 73.03,47.31
  Bottom 0.406: v75.56,53.18 76.2,52.86 87.31,52.86 89.22,54.77 96.52,54.77 98.42,56.67 v99.69,57.31
  Bottom 1.016: DD2.77 73.82,46.83
AVR_WAIT  (via drill 0.8 pad 2.18)
  Top 0.406: v45.09,49.05 43.81,50.32 43.81,56.99 45.72,58.9 67.15,58.9 68.9,61.12 72.39,61.12 v73.34,59.21
  Bottom 0.305: DD2.15 48.89,41.75 46.35,41.75 46.04,42.07
  Bottom 0.406: 46.04,42.07 46.04,48.1 v45.09,49.05 | v73.34,59.21 80.96,59.21 81.91,58.26 86.36,58.26 87.31,59.21 87.31,60.17 94.61,67.47 DD7.4
AY_BC  (via drill 0.8 pad 2.18)
  Top 0.406: v48.26,56.36 48.58,55.09 50.16,53.82 55.88,53.82 57.63,54.61 66.2,54.61 67.94,52.86 67.94,47.31
  Top 1.016: DD2.81 67.94,47.31
  Bottom 0.406: DD9.29 46.35,69.06 42.55,69.06 41.27,68.1 38.42,68.1 38.1,67.79 38.1,66.52 v48.26,56.36
AY_BDIR  (via drill 0.8 pad 2.18)
  Top 0.305: DD2.80 71.75,44.29 71.75,46.83 | 55.24,56.83 54.61,56.99 51.75,56.99 v50.8,55.72
  Top 0.406: 71.75,46.83 71.75,53.66 68.58,56.83 55.24,56.83
  Bottom 0.406: v50.8,55.72 48.89,54.45 46.99,54.45 42.23,60.48 36.83,66.2 36.83,68.1 37.78,69.06 40.64,69.06 DD9.27
  Bottom 1.016: DD2.80 70.01,42.07
AY_CLK  (via drill 0.8 pad 2.18)
  Top 0.406: v53.34,55.4 53.66,55.72 67.31,55.72 70.48,52.55 70.48,47.31
  Top 1.016: DD2.79 70.48,47.31
  Bottom 0.406: v53.34,55.4 50.8,52.23 50.8,49.37 49.85,48.42 47.62,48.42 46.42,50.3 45.09,51.28 39.05,58.9 35.88,62.07 33.66,62.07 32.07,63.66 32.07,66.83 29.53,69.37 DD9.22
B
  Bottom 1.016: R10.1 48.89,13.97 DD2.33
B_OUT
  Bottom 0.406: DA1.21 19.69,80.8 R11P.1
BB
  Bottom 0.406: 46.35,22.7 44.13,24.29 R7.1
  Bottom 1.016: DD2.28 46.35,22.7
BG
  Bottom 0.305: DD2.27 48.89,23.97 46.35,23.97
  Bottom 0.406: R6.1 40.16,24.76 41.59,26.19 43.81,26.19 46.35,23.97
  Bottom 1.016: DD2.27 51.91,24.45
BR
  Bottom 0.305: DD2.29 48.89,21.43 46.03,21.43 R5.1
  Bottom 1.016: DD2.29 51.75,22.7
BUSRQ
  Bottom 0.406: R21.2 118.11,71.12 123.35,71.12 124.46,70.01 DD1.25
C_OUT
  Bottom 0.305: 16.19,76.99 19.68,76.99 | 19.68,69.37 16.51,69.37
  Bottom 0.406: 19.68,69.37 20.95,70.64 20.95,75.72 20,76.99 19.68,76.99 | 16.19,76.99 15.24,77.95 15.24,84.93 13.97,86.2 13.97,90.49 10.79,93.66 10.16,93.66 9.21,94.62 JP2.3 | 16.51,69.37 16.19,69.37 15.56,68.74 15.56,66.2 16.19,65.56 DA1.15
CDDAT3  (via drill 0.8 pad 2.18)
  Top 0.406: v31.43,37.94 33.08,36.29 X4.1 33.08,23.08 32.23,22.22 R33.1
  Bottom 0.406: v31.43,37.94 31.43,40.48 R16.1 31.43,41.75 34.61,41.75 VT1.C
CLK  (via drill 0.8 pad 2.18)
  Top 0.305: 98.42,68.74 101.6,68.74
  Top 0.406: DD7.13 101.6,90.33 102.39,89.54 102.39,69.53 101.6,68.74 | 98.42,68.74 98.11,68.74 96.2,66.83 96.2,57.94 v96.52,57.63 | v48.89,50.32 47.31,50.32 45.72,51.91 45.72,53.5 46.67,54.45 47.62,54.45 50.01,52.7 56.83,52.7 58.42,53.5 64.45,53.5 65.72,52.23 v65.72,51.59 65.72,48.26 65.41,47.31 | v34.29,64.29 33.34,62.39 30.16,59.21 30.16,55.56 28.89,54.29 23.02,54.29 20.64,51.91 DD11.6
  Top 1.016: 65.41,47.31 DD2.83
  Bottom 0.406: v96.52,57.63 95.57,56.36 94.61,56.04 88.9,56.04 87.31,54.45 77.79,54.45 77.15,55.09 74.3,55.09 72.39,53.18 66.67,53.18 v65.72,51.59 | 48.26,49.69 v48.89,50.32 47.31,50.32 46.04,51.59 44.77,53.18 40.32,59.21 35.88,63.66 v34.29,64.29
CLK_CPU
  Top 0.305: DD2.22 48.89,31.59 51.59,31.59 51.91,31.91 55.09,31.91 56.04,31.27 | 74.77,31.59 80.96,31.59 82.23,32.86 87.63,32.86
  Top 0.406: 56.04,31.27 70.33,31.27 71.44,30.16 73.34,30.16 74.45,31.59 74.77,31.59 | DD1.6 112.71,95.41 113.35,94.77 113.35,58.26 101.6,46.51 100.01,46.51 95.89,42.39 93.34,42.39 91.44,40.48 91.44,34.45 89.85,32.86 87.63,32.86 | 46.2,30.32 45.72,30.32 43.18,32.86 R24.2
  Top 1.016: DD2.22 46.2,30.32
D0
  Top 0.305: 139.06,83.98 134.62,83.98
  Top 0.406: 134.62,83.98 132.72,82.07 132.72,78.9 133.98,77.63 DD8.13 | DD7.40 83.19,59.85 82.23,60.8 82.23,62.07 75.88,68.74 68.58,68.74 67.63,69.69 DD9.37 | 139.06,83.98 142.56,80.49 142.56,63.02 139.38,59.85 DD10.7
  Bottom 0.305: DD8.13 133.35,77.63 130.49,78.9 125.09,78.9 | 143.19,50.64 143.19,47.47 | DD1.14 107,75.09 | 101.6,73.82 98.42,73.82 | 86.68,63.66 83.19,63.66
  Bottom 0.406: DD10.7 139.37,55.41 143.19,51.59 143.19,50.64 | DD3.18 140.97,39.21 142.88,41.12 142.88,46.51 143.19,46.83 143.19,47.47 | 125.09,78.9 123.83,78.9 121.44,76.2 114.78,76.2 113.66,75.09 DD1.14 | DD7.40 83.19,59.85 82.23,60.8 82.23,62.71 83.19,63.66 | 86.68,63.66 87.31,63.66 92.71,69.06 92.71,69.69 96.84,73.82 98.42,73.82 | 101.6,73.82 102.71,73.82 103.98,75.09 107,75.09
  Bottom 0.813: DD9.37 R25.1
D1
  Top 0.305: 138.11,81.44 134.62,81.44 | 134.62,78.9 137.79,78.9
  Top 0.406: 134.62,78.9 134.3,78.9 133.67,79.53 133.67,80.8 134.3,81.44 134.62,81.44 | 137.79,78.9 138.75,77.95 138.75,76.36 137.48,75.09 DD8.14 | DD9.36 65.09,73.5 66.36,74.77 75.56,74.77 80.96,67.47 80.96,65.56 84.14,62.39 DD7.39 | 138.11,81.44 138.43,81.44 140.65,79.22 140.65,65.88 136.84,62.07 DD10.8
  Bottom 0.305: 128.27,73.82 124.78,73.82 | 153.35,47.15 153.35,50.64 | 145.73,54.77 145.73,58.26 | 101.92,68.74 98.11,68.74 | DD1.15 109.86,72.55 109.54,72.23 106.68,72.23
  Bottom 0.406: 153.35,50.64 153.35,51.28 150.5,54.13 146.37,54.13 145.73,54.77 | 145.73,58.26 145.1,58.9 137.48,58.9 136.84,58.26 DD10.8 | DD3.15 150.18,39.21 149.22,40.16 149.22,43.66 151.76,46.2 153.35,47.15 | 124.78,73.82 115.89,73.82 114.62,72.55 DD1.15 | 106.68,72.23 105.41,72.23 101.92,68.74 | DD7.39 87.63,62.39 93.98,68.74 98.11,68.74 | DD8.14 129.54,75.09 128.27,73.82
  Bottom 0.813: DD9.36 R26.1
D2
  Top 0.406: DD9.35 62.55,74.77 63.82,76.04 76.2,76.04 82.23,67.79 82.23,66.52 83.82,64.93 DD7.38
  Bottom 0.305: 112.71,76.36 108.27,76.36 | 98.42,76.36 101.76,76.36
  Bottom 0.406: 112.71,76.36 113.03,76.36 113.66,76.99 113.66,79.53 113.03,80.17 DD1.12 | DD7.38 87,64.93 91.44,69.37 91.44,70.96 96.84,76.36 98.42,76.36 | 108.27,76.36 J1.1 108.14,76.36 101.76,76.36
  Bottom 0.813: DD9.35 R27.1
D2.
  Top 0.406: DD8.15 137.79,72.55 138.43,71.91 138.43,68.42 134.3,64.29 DD10.9
  Bottom 0.305: 140.65,50.64 140.65,47.47 | 137.79,76.36 134.62,76.36 | 124.78,76.36 127.95,76.36 | 113.98,73.82 109.54,73.82
  Bottom 0.406: DD10.9 134.29,53.51 135.25,52.55 138.75,52.55 140.65,50.64 | 140.65,47.47 140.65,47.15 140.34,46.83 140.34,43.66 138.43,41.75 DD3.17 | 137.79,76.36 138.11,76.36 138.75,75.72 138.75,73.18 138.11,72.55 DD8.15 | 124.78,76.36 123.51,76.36 122.08,74.93 115.09,74.93 113.98,73.82 | 127.95,76.36 134.62,76.36 | 109.54,73.82 108.4,73.82 J1.2
D3
  Top 0.305: 145.73,47.47 145.73,51.28 147.32,52.86 150.18,52.86 152.08,54.77 152.08,56.5 DD10.2
  Top 0.406: DD3.21 138.11,31.59 145.1,38.58 145.1,45.88 145.73,46.51 145.73,47.47 | DD8.17 151.45,58.9 DD10.2 | DD9.34 60.01,76.68 60.64,77.31 76.52,77.31 84.14,67.47 DD7.37
  Bottom 0.305: 138.43,81.44 134.3,81.44 127.95,83.98 124.46,83.98 | 149.54,73.82 153.35,73.82 153.99,74.77 153.99,75.72 153.35,76.36 149.86,76.36 | 101.28,89.06 98.42,89.06
  Bottom 0.406: 138.43,81.44 143.51,76.36 149.86,76.36 | 149.54,73.82 148.59,72.87 148.59,70.96 149.54,70.01 DD8.17 | 124.46,83.98 113.35,90.33 DD1.8 109.22,90.33 108.27,91.28 104.14,91.28 101.92,89.06 101.28,89.06 | DD7.37 86.2,67.47 88.42,69.69 88.42,81.28 90.49,83.34 93.34,83.34 94.93,84.93 94.93,86.2 97.79,89.06 98.42,89.06
  Bottom 0.813: DD9.34 R28.1
D4
  Top 0.305: 143.19,47.47 143.19,50.96 146.05,53.82 148.59,53.82 149.54,54.77 149.54,56.5 DD10.3 149.54,57.79
  Top 0.406: DD3.20 138.11,34.13 143.19,39.21 143.19,47.47 | DD9.33 57.47,76.36 59.69,78.58 77.15,78.58 83.5,70.64 DD7.36 | DD8.18 149.86,72.55 148.91,71.6 148.91,66.83 149.54,66.2 DD10.3
  Bottom 0.305: 138.11,83.98 134.62,83.98 127.95,86.52 122.55,86.52 | 149.86,78.9 153.35,78.9 | 101.6,91.6 98.42,91.6
  Bottom 0.406: 122.55,86.52 DD1.7 103.19,92.87 101.92,91.6 101.6,91.6 | 138.11,83.98 143.19,78.9 149.86,78.9 | DD8.18 153.99,72.55 155.26,74.14 155.26,76.99 153.35,78.9 | DD7.36 86.04,70.01 87.31,71.28 87.31,81.91 90.01,84.61 92.39,84.61 93.66,85.88 93.66,87.47 97.79,91.6 98.42,91.6
  Bottom 0.813: DD9.33 R29.1
D5
  Top 0.406: DD7.35 83.5,72.87 77.79,79.85 59.05,79.85 54.93,75.72 DD9.32 | DD8.19 149.86,75.09 147.64,72.87 147.64,58.9 146.99,58.25 DD10.4
  Bottom 0.305: 138.11,78.9 133.98,78.9 127.95,81.44 123.19,81.44 | 101.6,86.52 98.42,86.52 | 86.68,66.2 83.19,66.2
  Bottom 0.406: DD8.19 141.92,75.09 138.11,78.9 | 123.19,81.44 113.03,87.79 DD1.9 109.54,87.79 101.6,86.52 | DD10.4 146.99,58.25 147.64,58.9 155.26,58.9 156.21,57.94 156.21,41.43 153.99,39.21 153.99,35.4 152.72,34.13 DD3.13 | 83.19,66.2 82.87,66.2 82.23,66.83 82.23,71.91 82.87,72.55 DD7.35 | 86.68,66.2 89.85,69.37 89.85,74.61 89.53,74.93 89.53,80.49 91.12,82.07 93.98,82.07 98.42,86.52
  Bottom 0.813: DD9.32 R30.1
D6  (via drill 0.8 pad 2.18)
  Top 0.305: 140.65,50.32 140.65,47.47 | 112.71,99.22 109.54,99.22 | 119.54,69.85 117.16,66.83 | 119.54,80.01 118.11,78.1
  Top 0.406: DD3.19 138.11,36.67 140.65,39.21 140.65,47.47 | 140.65,50.32 140.65,50.64 144.46,54.45 144.46,56.5 DD10.5 144.46,58.26 146.37,60.17 146.37,73.82 150.18,77.63 DD8.20 | 109.54,99.22 108.9,98.58 108.9,85.88 109.54,85.25 DD1.10 | v121.6,34.13 120.97,34.77 120.97,54.77 117.16,58.58 117.16,66.83 | 112.71,99.22 116.2,99.22 118.43,97 118.43,94.14 119.38,92.87 119.38,91.92 118.11,90.65 118.11,84.3 119.54,82.87 119.54,80.01 | v91.12,76.68 88.9,76.68 87.31,75.09 DD7.34 83.82,75.09 78.42,81.12 58.42,81.12 52.39,75.09 DD9.31 | 118.11,78.1 118.11,77.31 118.9,76.52 118.9,72.39 119.54,71.76 119.54,69.85
  Bottom 0.305: 101.6,83.98 98.42,83.98
  Bottom 0.406: DD3.19 132.72,36.67 129.22,34.13 v121.6,34.13 | 101.6,83.98 109.54,85.25 DD1.10 | v91.12,76.68 90.49,77.63 90.49,79.53 91.76,80.8 95.25,80.8 98.42,83.98
  Bottom 0.813: DD9.31 R31.1
D7  (via drill 0.8 pad 2.18)
  Top 0.305: 153.35,50.64 153.35,47.15
  Top 0.406: 153.35,47.15 148.91,42.7 148.91,37.31 149.54,36.67 DD3.14 | 153.35,50.64 153.35,50.96 156.53,54.13 156.53,57.94 155.57,58.9 155.57,66.83 157.48,68.74 157.48,70.64 155.57,72.55 155.57,77.95 153.35,80.17 DD8.21 | v107.63,69.69 v107.63,78.9 108.9,78.9 110.17,77.63 DD1.13 | v92.39,78.9 88.58,78.9 87.31,77.63 DD7.33 83.82,77.63 79.38,82.39 57.47,82.39 49.85,74.77 DD9.30
  Bottom 0.305: 150.81,50.64 150.81,47.15 | 124.46,68.74 128.59,68.74 | 134.62,68.74 138.11,68.74 | 101.6,78.9 98.42,78.9 | 112.71,68.74 109.54,68.74
  Bottom 0.406: DD10.6 141.91,55.1 144.15,52.86 149.54,52.86 150.81,51.59 150.81,50.64 | DD8.21 154.31,80.17 156.53,77.95 156.53,73.5 154.94,71.6 154.62,71.6 153.67,70.64 153.67,69.37 152.72,68.42 148.59,68.42 147.48,69.53 140.65,69.53 140.18,69.37 138.11,68.74 | DD3.14 149.54,36.67 147.96,38.26 147.96,44.29 150.81,47.15 | 128.59,68.74 134.62,68.74 | 112.71,68.74 113.98,68.74 115.25,67.47 117.16,67.47 119.54,69.85 122.4,69.85 123.51,68.74 124.46,68.74 | 98.42,78.9 v92.39,78.9 | 101.6,78.9 101.92,78.9 103.19,77.63 106.05,77.63 v107.63,78.9 108.9,78.9 110.17,77.63 DD1.13 | 109.54,68.74 108.58,68.74 v107.63,69.69
  Bottom 0.813: DD9.30 R32.1
FC  (via drill 0.8 pad 2.18)
  Top 0.305: 16.19,74.45 19.68,74.45 | 9.68,74.45 6.03,74.45 C12P.1
  Top 0.406: v43.18,67.15 42.23,68.1 34.77,68.1 33.97,68.58 26.99,68.58 26.19,68.1 21.75,68.1 20.64,69.21 20.64,73.5 19.68,74.45 | 16.19,74.45 9.68,74.45
  Bottom 0.406: DD12.9 51.12,63.02 46.99,67.15 45.4,67.15 | 45.4,67.15 v43.18,67.15 | J3.2 45.4,67.15
FCI  (via drill 0.8 pad 2.18)
  Top 0.406: v40.64,66.2 39.85,66.99 33.66,66.99 31.75,65.09 31.75,63.5 28.89,60.64 28.89,58.42 27.15,56.67 DD11.8
  Bottom 0.305: DD12.11 56.2,59.85 55.24,58.9 50.48,58.9 49.85,59.53 49.85,62.07
  Bottom 0.406: 49.85,62.07 49.85,62.39 47.31,64.93 45.72,64.93 | 45.72,64.93 41.91,64.93 v40.64,66.2 | J3.1 45.72,64.93
G
  Bottom 0.305: DD2.34 48.26,15.72
  Bottom 0.406: 48.26,15.72 45.72,15.72 45.09,16.35 45.09,17.3 R9.1
G_OUT
  Bottom 0.406: DA1.22 19.69,83.34 R10P.1
GND  (via drill 0.8 pad 1.78, 0.8 pad 2.18)  (1 unrouted)
  Top 0.305: 86.36,91.6 83.19,91.6 | 86.36,94.14 83.19,94.14 | 46.04,69.06 46.67,68.42 DD12.7 | DD2.47 66.67,16.99 66.67,18.57 65.88,19.37 61.12,19.37 DD2.42 | 12.51,20.03 9.65,20.03 8.73,20.96 8.73,23.34 9.68,24.29 12.27,24.29
  Top 0.406: 56.52,83.66 75.25,83.66 DD9.1 | DD7.11 99.06,85.25 | 83.19,91.6 82.23,91.6 82.23,93.5 82.39,93.66 82.87,94.14 83.19,94.14 | 20.38,17.88 20.64,17.62 | X4.3 28,31.59 20.38,31.59 | 20.38,31.59 X4.6 20.38,37.53 v21.91,39.05 | 39.69,41.75 39.69,31.59 X4.M1 | 46.04,69.06 35.72,69.06 34.61,70.17 DD9.24 | X5.10 37.78,55.09 38.73,56.04 41.59,56.04 42.55,55.09 42.55,42.7 41.59,41.75 39.69,41.75 | 39.69,41.75 39.37,41.75 37.78,43.34 X5.2 | C6P.- 23.81,63.02 19.68,58.9 13.02,58.9 11.43,60.48 | 11.43,60.48 11.43,72.23 10.48,73.18 DA1.7 | R34.1 8.58,36.67 12.38,33.81 12.38,31.72 X4.M4 | 12.57,28.67 12.57,28.42 12.27,28.42 | 11.43,60.48 9.84,58.9 6.99,58.9 5.56,57.47 5.56,40.96 | 52.23,35.4 v53.66,36.83 | v21.91,39.05 23.97,41.12 C9.- | v21.91,39.05 21.91,45.08 23.18,46.36 DD11.7 v24.13,51.12 | 20.38,31.59 16.83,31.59 16.35,31.12 16.35,30.64 14.29,28.58 12.27,28.58 12.27,28.89
  Top 0.61: DD8.2 133.98,105.57 131.44,101.76 131.44,97 131.13,96.04 | X6.6 24.92,51.91 v24.13,51.12 | 86.36,94.14 87.15,94.14 88.27,93.03 | 86.36,91.6 87,91.6 88.27,92.87
  Top 0.813: 128.27,26.64 DD5.10 | DD3.16 154.31,41.75 157.16,38.89 v157.16,37.62 | DD7.31 81.91,82.71 78.11,86.52 DD9.1 75.25,86.68 v74.61,89.54 | 81.91,102.39 81.91,94.14 82.39,93.66 | 56.52,83.66 55.24,83.66 46.04,74.45 35.88,74.45 34.61,73.18 DD9.24 | DD2.19 52.23,35.4 | v2.54,11.75 1.91,12.38 1.91,93.03 | 1.91,93.03 1.91,94.62 v3.81,96.52 | C17.- 1.91,93.03 | 75.25,103.51 77.95,106.2 | 77.95,106.2 78.11,106.36 | v21.27,66.36 23.49,65.09 C6P.- | X1.P$2 77.95,106.2 | 99.06,85.25 98.9,85.25 97.47,86.68 97.47,89.22 97.16,89.54
  Top 1.016: X4.M1 38.15,29.69 38.15,29.21 | DD2.32 X4.M2 | X4.M2 20.64,17.62 X4.M3 12.51,20.03 | DA1.24 DA1.1 | X4.M4 12.27,28.89 12.27,28.42 12.27,24.29 | 38.15,29.21 38.15,27.89 39.69,26.35 X4.M2 | v40,29.37 38.31,29.37 38.15,29.21 | DD2.42 60.32,18.89 | DD2.47 67.94,13.65
  Top 1.27: 130.18,80.17 DD1.29 | X1.P$2 81.91,102.39 | 97.16,89.54 93.66,93.03 88.27,93.03
  Top 1.676: DD10.10 131.75,59.05 131.76,59.05 | DD8.16 132.24,70.01 132.08,69.85
  Top 1.778: DD4.10 113.67,39.21 v113.66,41.43 | 126.21,42.23 126.21,52.39 130.33,56.51 DD10.10 | 131.76,59.05 132.08,60.33
  Top 1.93: DD5.10 127.16,27.51 127.16,40.96 126.21,42.23
  Top 2.54: 131.13,96.04 130.18,95.09 130.18,80.17 130.18,77.15 132.08,75.25 132.08,69.85 132.08,60.33
  Bottom 0.305: DD2.72 76.83,39.21 74.61,39.21 | DD2.47 66.67,16.99 66.67,18.57 | 109.22,86.52 113.03,86.52 | 53.98,43.92 53.98,42.02 | DD2.42 61.59,16.19 61.59,14.13 61.28,13.81 | DD2.32 48.89,18.89 51.59,18.89 52.07,19.21 | 76.99,23.97 79.22,23.97 | C7P*.2 12.25,71.12
  Bottom 0.406: DD10.10 | 66.67,18.57 67.31,19.21 72.71,19.21 73.98,20.48 73.98,21.75 DD2.59 76.99,23.97 | DD2.82 65.09,40.16 62.39,40.16 61.28,39.05 | 53.98,39.05 53.98,42.01 53.98,42.02 | 101.28,85.25 DD7.11 | 61.28,13.81 61.28,11.43 61.59,11.11 C2.2 | C12.2 85.72,82.71 DD7.31 | 120.97,80.81 C3.2 | R45.2 75.4,79.06 C13.2 R48.2 | R18.1 35.88,25.24 36.27,25.64 | 36.27,25.64 v40,29.37 | R18.1 R14.1 27.3,25.24 | 27.3,25.24 26.67,25.24 22.86,25.24 R12.1 | DA2.1 R18.1 | X2.21 53.98,101.76 X2.18 53.66,108.11 | X2.17 51.75,91.6 50.8,90.65 44.77,90.65 | 44.77,90.65 37.46,90.65 | X2.13 44.77,94.77 44.77,90.65 | X2.9 37.46,94.46 37.46,90.65 | 37.46,90.65 31.75,90.65 30.8,91.6 30.8,94.77 X2.5 | DD12.7 51.3,65.69 C4.2 | C8.2 27.3,25.24 | R5P*.1 12.25,71.12 12.25,68.87 12.7,68.42 C4P.1 12.7,65.88 11.62,64.8 C5P.1 | R6P.1 23.18,62.87 C6P.- | 160.66,106.84 X3.GND 163.29,106.9 165.73,104.46 165.73,95.88 164.47,94.62 X3P.4 | v53.66,36.83 53.98,39.05 | 74.61,39.21 C10.2 | 72.39,38.74 C10.2 | 61.28,39.05 61.28,36.19 62.23,35.24 64.14,35.24 65.72,36.83 65.72,37.47 67.31,39.05 69.21,39.05 69.85,39.05 72.39,39.05 C10.2 | 52.07,19.21 59.37,19.21 60.32,18.73 | C9.- 23.65,40.8 v21.91,39.05 | 53.98,43.92 DD2.7 | 53.98,39.05 61.28,39.05 | 79.22,23.97 v83.03,27.3 | C14.2 10.79,52.07 11.43,51.44 23.81,51.44 v24.13,51.12 | C7.2 36.27,25.64
  Bottom 0.61: DD4.10 | 128.14,26.51 DD5.10 | DD8.2 143.19,105.57 146.81,102.9 C6.2 | DD3.16 153.48,41.75 C5.2 | DD10.10 131.76,58.58 134.62,61.44 156.53,61.44 158.75,59.21 158.75,39.21 v157.16,37.62 | 120.97,81.44 113.03,86.52 | R_SY.3 R_R.3 R_G.3 R_B.3 | 53.66,108.74 53.66,108.11 | DA1.1 9.37,88.42 11.12,86.68 C16.2 11.12,74.96 R5P*.1 11.62,73.18 DA1.7 | VT1.E 36.83,32.7 38.42,31.12 38.42,29.69 38.73,29.37 v40,29.37
  Bottom 0.813: DD4.10 115.89,26.51 119.06,28.42 122.87,28.42 125.08,26.52 DD5.10 | R45.2 DD9.1 75.25,87.47 73.37,90.3 70.48,90.3 | DD8.30 C6.2 | DD6.P$14 92.39,39.21 | 109.22,86.52 101.28,85.25 | X2.4 X2.5 | X2.14 X2.13 | X2.18 X2.17 | X1.P$2 X1.P$3 73.34,102.12 65.72,94.49 65.72,92.07 67.5,90.3 C1.- 70.48,90.3 | R_B.3 38.58,4.29 33.02,9.84 9.84,9.84 7.94,11.75 v2.54,11.75 | 53.66,110.49 53.66,108.74 | v83.03,40.48 DD2.72 | C15.2 70.48,90.3 | v21.27,66.36 22.86,65.25 C6P.-
  Bottom 1.016: 92.39,39.21 90.17,41.27 84.61,41.27 v83.03,40.48 | DD8.30 157.18,103.03 | 157.18,103.03 X3.3 | 157.18,103.03 157.18,104 160.66,106.84 | 120.97,81.44 120.97,80.81 | DD2.42 60.32,18.73 | DD2.7 55.24,46.99 | DD1.29 121.28,80.17 C3.2
  Bottom 1.27: DD6.P$14 DD6.14 101.92,39.53 111.76,39.53 v113.66,41.43 | DA1.1 5.87,88.42 3.81,90.49 C17.- v3.81,96.52 8.41,101.12 8.41,107.79
  Bottom 1.778: 11.11,110.49 8.41,107.79
  Bottom 2.54: X1.P$3 68.57,110.49 60.32,110.49 59.85,110.97 53.5,110.97 | 53.5,110.97 11.59,110.97 11.11,110.49 | 53.66,110.49 53.66,110.81 53.5,110.97
INT
  Top 0.305: DD2.21 54.93,32.86 56.67,32.23 | 74.93,34.13 81.6,34.13 82.87,35.4 87.63,35.4
  Top 0.406: DD1.16 108.58,68.1 108.58,55.72 100.65,47.78 99.38,47.78 95.25,43.66 92.08,43.66 90.17,41.75 90.17,36.04 89.53,35.4 87.63,35.4 | 56.67,32.23 70.64,32.23 72.55,34.13 74.93,34.13
IOREQ  (via drill 0.8 pad 2.18)
  Top 0.305: DD2.20 48.58,34.13 54.61,34.13 56.52,33.18 | 74.93,36.67 79.38,36.67 | 84.77,37.94 87.95,37.94
  Top 0.406: v100.97,50.96 99.06,49.05 98.74,49.05 94.61,44.93 90.8,44.93 88.9,43.02 88.9,38.26 88.58,37.94 87.95,37.94 | 56.52,33.18 69.85,33.18 73.34,36.67 74.93,36.67 | 79.38,36.67 80.64,37.94 84.77,37.94
  Top 1.016: DD2.20 46.2,32.86
  Bottom 0.406: v100.97,50.96 105.73,50.96 111.12,56.36 DD1.20
KCLK  (via drill 0.8 pad 2.18)
  Top 0.305: 124.46,99.22 128.27,99.22 | 137.79,101.76 134.3,101.76 133.67,101.12 133.67,99.85 134.3,99.22 137.79,99.22 | 109.22,104.3 112.71,104.3
  Top 0.406: DD7.16 101.6,97.95 102.55,98.9 102.55,105.57 104.14,107.16 107.31,107.16 108.58,105.89 108.58,104.93 109.22,104.3 | 124.46,99.22 119.7,99.22 114.62,104.3 112.71,104.3 | 128.27,99.22 128.59,99.22 129.22,99.85 129.22,101.76 133.35,108.74 134.3,109.7 137.79,109.7 139.38,108.11 139.38,102.71 138.43,101.76 137.79,101.76 | 137.79,99.22 140.34,99.22 142.88,101.76 v142.88,103.03
  Bottom 0.305: 149.86,101.76 153.03,101.76 | 155.89,96.52 155.89,99.33
  Bottom 0.406: v142.88,103.03 144.15,103.03 146.69,101.12 149.22,101.12 149.86,101.76 | 155.89,100.6 155.46,100.6 154.31,101.76 153.03,101.76 | 155.89,100.6 X3.5 | 155.89,99.33 155.89,100.6 | X3P.1 156.84,95.57 | 156.84,95.57 155.89,96.52 | 156.84,95.57 158.75,95.57 159.87,96.69 R23.2
KDAT  (via drill 0.8 pad 2.18)
  Top 0.305: 109.54,101.76 112.71,101.76 | 124.78,96.68 127.95,96.68 | 130.49,102.08 133.35,106.84 137.48,106.84 | 137.48,104.3 134.62,104.3 | 134.62,96.68 137.79,96.68
  Top 0.406: 137.48,106.84 137.79,106.84 138.43,106.2 138.43,104.93 137.79,104.3 137.48,104.3 | 134.62,96.68 134.3,96.68 132.72,98.27 132.72,101.76 134.62,104.3 | 127.95,96.68 130.18,98.9 130.18,101.76 130.49,102.08 | 124.78,96.68 124.46,96.68 123.83,97.31 119.7,97.31 115.25,101.76 112.71,101.76 | 109.54,101.76 109.22,101.76 107.63,100.17 107.63,87.79 105.73,85.88 105.73,66.83 107,65.56 107,59.85 105.73,58.58 103.82,58.58 102.55,59.85 102.55,64.29 101.92,64.93 DD7.3 | 137.79,96.68 140.02,96.68 v141.29,95.41
  Bottom 0.305: 148.91,91.6 153.03,91.6
  Bottom 0.406: v141.29,95.41 144.78,95.41 148.91,91.6 | 153.03,91.6 153.35,91.6 154.94,93.19 154.94,96.2 154.47,96.67 J2.1
KDATR
  Bottom 0.305: 161.29,96.2 161.3,98.87
  Bottom 0.406: X3.1 R22.1 | 161.3,98.87 R22.1 | J2.2 159.38,100.01 159.7,100.8 R22.1 | X3P.2 159.38,94.3 161.29,96.2
M1  (via drill 0.8 pad 2.18)
  Top 0.305: DD2.16 48.58,39.21 51.12,39.21 52.7,40.8 72.87,40.8 74.3,42.23 74.3,47.15
  Top 0.406: DD1.27 128.27,75.09 129.22,74.14 129.22,58.9 127,56.67 v125.41,56.67 | 74.3,47.15 76.2,49.05 v92.08,49.05
  Top 1.016: DD2.16 46.2,37.94
  Bottom 0.406: v125.41,56.67 115.89,56.67 107,47.78 94.61,47.78 v92.08,49.05
MISO  (via drill 0.8 pad 2.18)